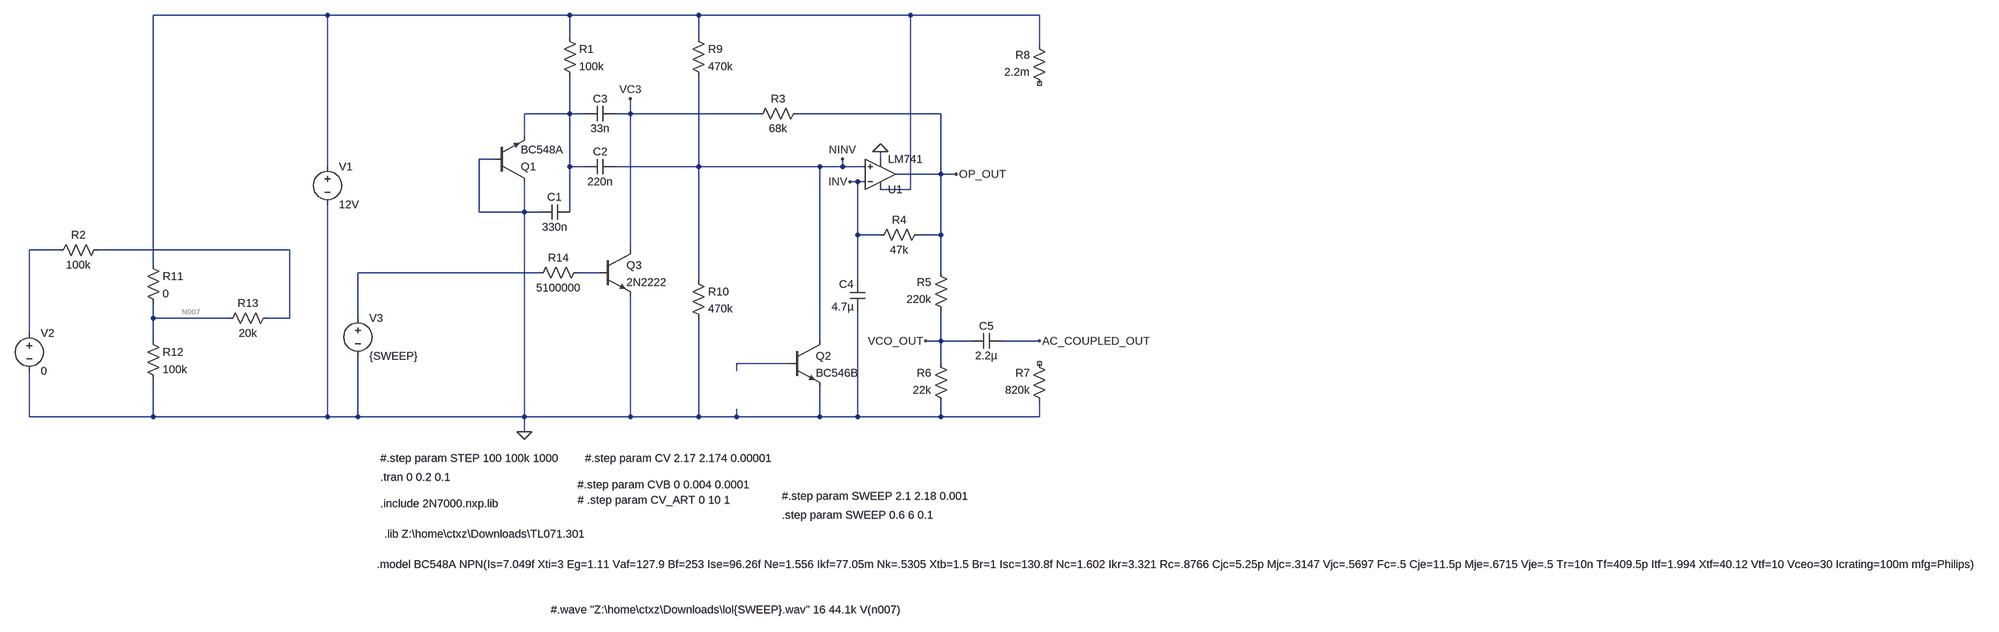
[diagram p0: schematic Dampflockpfeife.asc]
Dampflockpfeife.asc, the LTspice schematic file:
Version 4
SHEET 1 3656 1112
WIRE -224 -160 -592 -160
WIRE 288 -160 -224 -160
WIRE 560 -160 288 -160
WIRE 1008 -160 560 -160
WIRE 1280 -160 1008 -160
WIRE 288 -112 288 -160
WIRE 560 -112 560 -160
WIRE 1280 -96 1280 -160
WIRE 288 48 288 -32
WIRE 288 48 192 48
WIRE 320 48 288 48
WIRE 416 48 416 16
WIRE 416 48 384 48
WIRE 688 48 416 48
WIRE 1072 48 768 48
WIRE 192 96 192 48
WIRE 128 144 96 144
WIRE 944 144 944 128
WIRE -224 160 -224 -160
WIRE 288 160 288 48
WIRE 320 160 288 160
WIRE 560 160 560 -32
WIRE 560 160 384 160
WIRE 816 160 560 160
WIRE 864 160 864 144
WIRE 864 160 816 160
WIRE 912 160 864 160
WIRE 1072 176 1072 48
WIRE 1072 176 976 176
WIRE 1104 176 1072 176
WIRE 896 192 880 192
WIRE 912 192 896 192
WIRE 1008 208 1008 -160
WIRE 1008 208 944 208
WIRE 96 256 96 144
WIRE 192 256 192 192
WIRE 192 256 96 256
WIRE 224 256 192 256
WIRE 288 256 288 160
WIRE 896 304 896 192
WIRE 944 304 896 304
WIRE 1072 304 1072 176
WIRE 1072 304 1024 304
WIRE -960 336 -1024 336
WIRE -304 336 -880 336
WIRE 416 336 416 48
WIRE -592 368 -592 -160
WIRE 224 384 -160 384
WIRE 352 384 304 384
WIRE 1072 384 1072 304
WIRE 560 400 560 160
WIRE 896 400 896 304
WIRE -592 480 -592 448
WIRE -432 480 -592 480
WIRE -304 480 -304 336
WIRE -304 480 -352 480
WIRE -160 480 -160 384
WIRE -1024 512 -1024 336
WIRE -592 528 -592 480
WIRE 816 528 816 160
WIRE 1072 528 1072 464
WIRE 1072 528 1040 528
WIRE 1136 528 1072 528
WIRE 1280 528 1200 528
WIRE 752 576 640 576
WIRE 1072 576 1072 528
WIRE 640 592 640 576
WIRE -1024 688 -1024 592
WIRE -592 688 -592 608
WIRE -592 688 -1024 688
WIRE -224 688 -224 240
WIRE -224 688 -592 688
WIRE -160 688 -160 560
WIRE -160 688 -224 688
WIRE 192 688 192 256
WIRE 192 688 -160 688
WIRE 416 688 416 432
WIRE 416 688 192 688
WIRE 560 688 560 480
WIRE 560 688 416 688
WIRE 640 688 640 672
WIRE 640 688 560 688
WIRE 816 688 816 624
WIRE 816 688 640 688
WIRE 896 688 896 464
WIRE 896 688 816 688
WIRE 1072 688 1072 656
WIRE 1072 688 896 688
WIRE 1280 688 1280 656
WIRE 1280 688 1072 688
WIRE 192 720 192 688
FLAG 192 720 0
FLAG 944 128 0
FLAG 1040 528 VCO_OUT
FLAG 880 192 INV
FLAG 864 144 NINV
FLAG 1104 176 OP_OUT
FLAG 416 16 VC3
FLAG 1280 528 AC_COUPLED_OUT
SYMBOL npn 128 192 M180
SYMATTR InstName Q1
SYMATTR Value BC548A
SYMBOL cap 288 240 R90
WINDOW 0 0 32 VBottom 2
WINDOW 3 32 32 VTop 2
SYMATTR InstName C1
SYMATTR Value 330n
SYMBOL cap 384 144 R90
WINDOW 0 0 32 VBottom 2
WINDOW 3 32 32 VTop 2
SYMATTR InstName C2
SYMATTR Value 220n
SYMBOL cap 384 32 R90
WINDOW 0 0 32 VBottom 2
WINDOW 3 32 32 VTop 2
SYMATTR InstName C3
SYMATTR Value 33n
SYMBOL res 272 -128 R0
SYMATTR InstName R1
SYMATTR Value 100k
SYMBOL voltage -224 144 R0
WINDOW 123 0 0 Left 0
WINDOW 39 0 0 Left 0
SYMATTR InstName V1
SYMATTR Value 12V
SYMBOL OpAmps\\LM741 944 240 M180
SYMATTR InstName U1
SYMBOL res 784 32 R90
WINDOW 0 0 56 VBottom 2
WINDOW 3 32 56 VTop 2
SYMATTR InstName R3
SYMATTR Value 68k
SYMBOL cap 912 464 R180
WINDOW 0 24 56 Left 2
WINDOW 3 24 8 Left 2
SYMATTR InstName C4
SYMATTR Value 4.7µ
SYMBOL res 1040 288 R90
WINDOW 0 0 56 VBottom 2
WINDOW 3 32 56 VTop 2
SYMATTR InstName R4
SYMATTR Value 47k
SYMBOL res 1088 480 R180
WINDOW 0 36 76 Left 2
WINDOW 3 36 40 Left 2
SYMATTR InstName R5
SYMATTR Value 220k
SYMBOL res 1088 672 R180
WINDOW 0 36 76 Left 2
WINDOW 3 36 40 Left 2
SYMATTR InstName R6
SYMATTR Value 22k
SYMBOL cap 1136 544 R270
WINDOW 0 32 32 VTop 2
WINDOW 3 0 32 VBottom 2
SYMATTR InstName C5
SYMATTR Value 2.2µ
SYMBOL res 1296 672 R180
WINDOW 0 36 76 Left 2
WINDOW 3 36 40 Left 2
SYMATTR InstName R7
SYMATTR Value 820k
SYMBOL res 1296 0 R180
WINDOW 0 36 76 Left 2
WINDOW 3 36 40 Left 2
SYMATTR InstName R8
SYMATTR Value 2.2m
SYMBOL npn 752 528 R0
SYMATTR InstName Q2
SYMATTR Value BC546B
SYMBOL res 544 -128 R0
SYMATTR InstName R9
SYMATTR Value 470k
SYMBOL res 544 384 R0
SYMATTR InstName R10
SYMATTR Value 470k
SYMBOL voltage -1024 496 R0
WINDOW 123 0 0 Left 0
WINDOW 39 0 0 Left 0
SYMATTR InstName V2
SYMATTR Value 0
SYMBOL res -864 320 R90
WINDOW 0 0 56 VBottom 2
WINDOW 3 32 56 VTop 2
SYMATTR InstName R2
SYMATTR Value 100k
SYMBOL res -608 352 R0
SYMATTR InstName R11
SYMATTR Value 0
SYMBOL res -608 512 R0
SYMATTR InstName R12
SYMATTR Value 100k
SYMBOL res -336 464 R90
WINDOW 0 0 56 VBottom 2
WINDOW 3 32 56 VTop 2
SYMATTR InstName R13
SYMATTR Value 20k
SYMBOL voltage -160 464 R0
WINDOW 123 0 0 Left 0
WINDOW 39 0 0 Left 0
SYMATTR InstName V3
SYMATTR Value {SWEEP}
SYMBOL npn 352 336 R0
SYMATTR InstName Q3
SYMATTR Value 2N2222
SYMBOL res 320 368 R90
WINDOW 0 0 56 VBottom 2
WINDOW 3 32 56 VTop 2
SYMATTR InstName R14
SYMATTR Value 5100000
TEXT -112 776 Left 2 !#.step param STEP 100 100k 1000
TEXT -112 816 Left 2 !.tran 0 0.2 0.1
TEXT 320 776 Left 2 !#.step param CV 2.17 2.174 0.00001
TEXT -112 872 Left 2 !.include 2N7000.nxp.lib
TEXT 304 832 Left 2 !#.step param CVB 0 0.004 0.0001
TEXT -104 936 Left 2 !.lib Z:\\home\\ctxz\\Downloads\\TL071.301
TEXT 304 864 Left 2 !# .step param CV_ART 0 10 1
TEXT -120 1000 Left 2 !.model BC548A NPN(Is=7.049f Xti=3 Eg=1.11 Vaf=127.9 Bf=253 Ise=96.26f Ne=1.556 Ikf=77.05m Nk=.5305 Xtb=1.5 Br=1 Isc=130.8f Nc=1.602 Ikr=3.321 Rc=.8766 Cjc=5.25p Mjc=.3147 Vjc=.5697 Fc=.5 Cje=11.5p Mje=.6715 Vje=.5 Tr=10n Tf=409.5p Itf=1.994 Xtf=40.12 Vtf=10 Vceo=30 Icrating=100m mfg=Philips)
TEXT 736 856 Left 2 !#.step param SWEEP 2.1 2.18 0.001
TEXT 736 896 Left 2 !.step param SWEEP 0.6 6 0.1
TEXT 248 1096 Left 2 !#.wave "Z:\\home\\ctxz\\Downloads\\lol{SWEEP}.wav" 16 44.1k V(n007)

The netlist it stands for:
* Dampflockpfeife.asc
Q1 0 0 N002 0 BC548A
C1 N002 0 330n
C2 NINV N002 220n
C3 VC3 N002 33n
R1 N001 N002 100k
V1 N001 0 12V
XU1 NINV INV N001 0 OP_OUT LM741  ; pins In+ In- V+ V- OUT
R3 OP_OUT VC3 68k
C4 0 INV 4.7µ
R4 OP_OUT INV 47k
R5 VCO_OUT OP_OUT 220k
R6 0 VCO_OUT 22k
C5 VCO_OUT AC_COUPLED_OUT 2.2µ
R7 0 NC_01 820k
R8 NC_02 N001 2.2m
Q2 NINV N008 0 0 BC546B
R9 N001 NINV 470k
R10 NINV 0 470k
V2 N003 0 0
R2 N004 N003 100k
R11 N001 N007 0
R12 N007 0 100k
R13 N004 N007 20k
V3 N005 0 {SWEEP}
Q3 VC3 N006 0 0 2N2222
R14 N006 N005 5100000
.model NPN NPN
.model PNP PNP
.lib standard.bjt
#.step param STEP 100 100k 1000
.tran 0 0.2 0.1
#.step param CV 2.17 2.174 0.00001
.include 2N7000.nxp.lib
#.step param CVB 0 0.004 0.0001
.lib Z:\home\ctxz\Downloads\TL071.301
# .step param CV_ART 0 10 1
.model BC548A NPN(Is=7.049f Xti=3 Eg=1.11 Vaf=127.9 Bf=253 Ise=96.26f Ne=1.556 Ikf=77.05m Nk=.5305 Xtb=1.5 Br=1 Isc=130.8f Nc=1.602 Ikr=3.321 Rc=.8766 Cjc=5.25p Mjc=.3147 Vjc=.5697 Fc=.5 Cje=11.5p Mje=.6715 Vje=.5 Tr=10n Tf=409.5p Itf=1.994 Xtf=40.12 Vtf=10 Vceo=30 Icrating=100m mfg=Philips)
#.step param SWEEP 2.1 2.18 0.001
.step param SWEEP 0.6 6 0.1
#.wave "Z:\home\ctxz\Downloads\lol{SWEEP}.wav" 16 44.1k V(n007)
.lib LM741.lib
.backanno
.end